# Altium project STM32H743VGT6核心板.PrjPcb
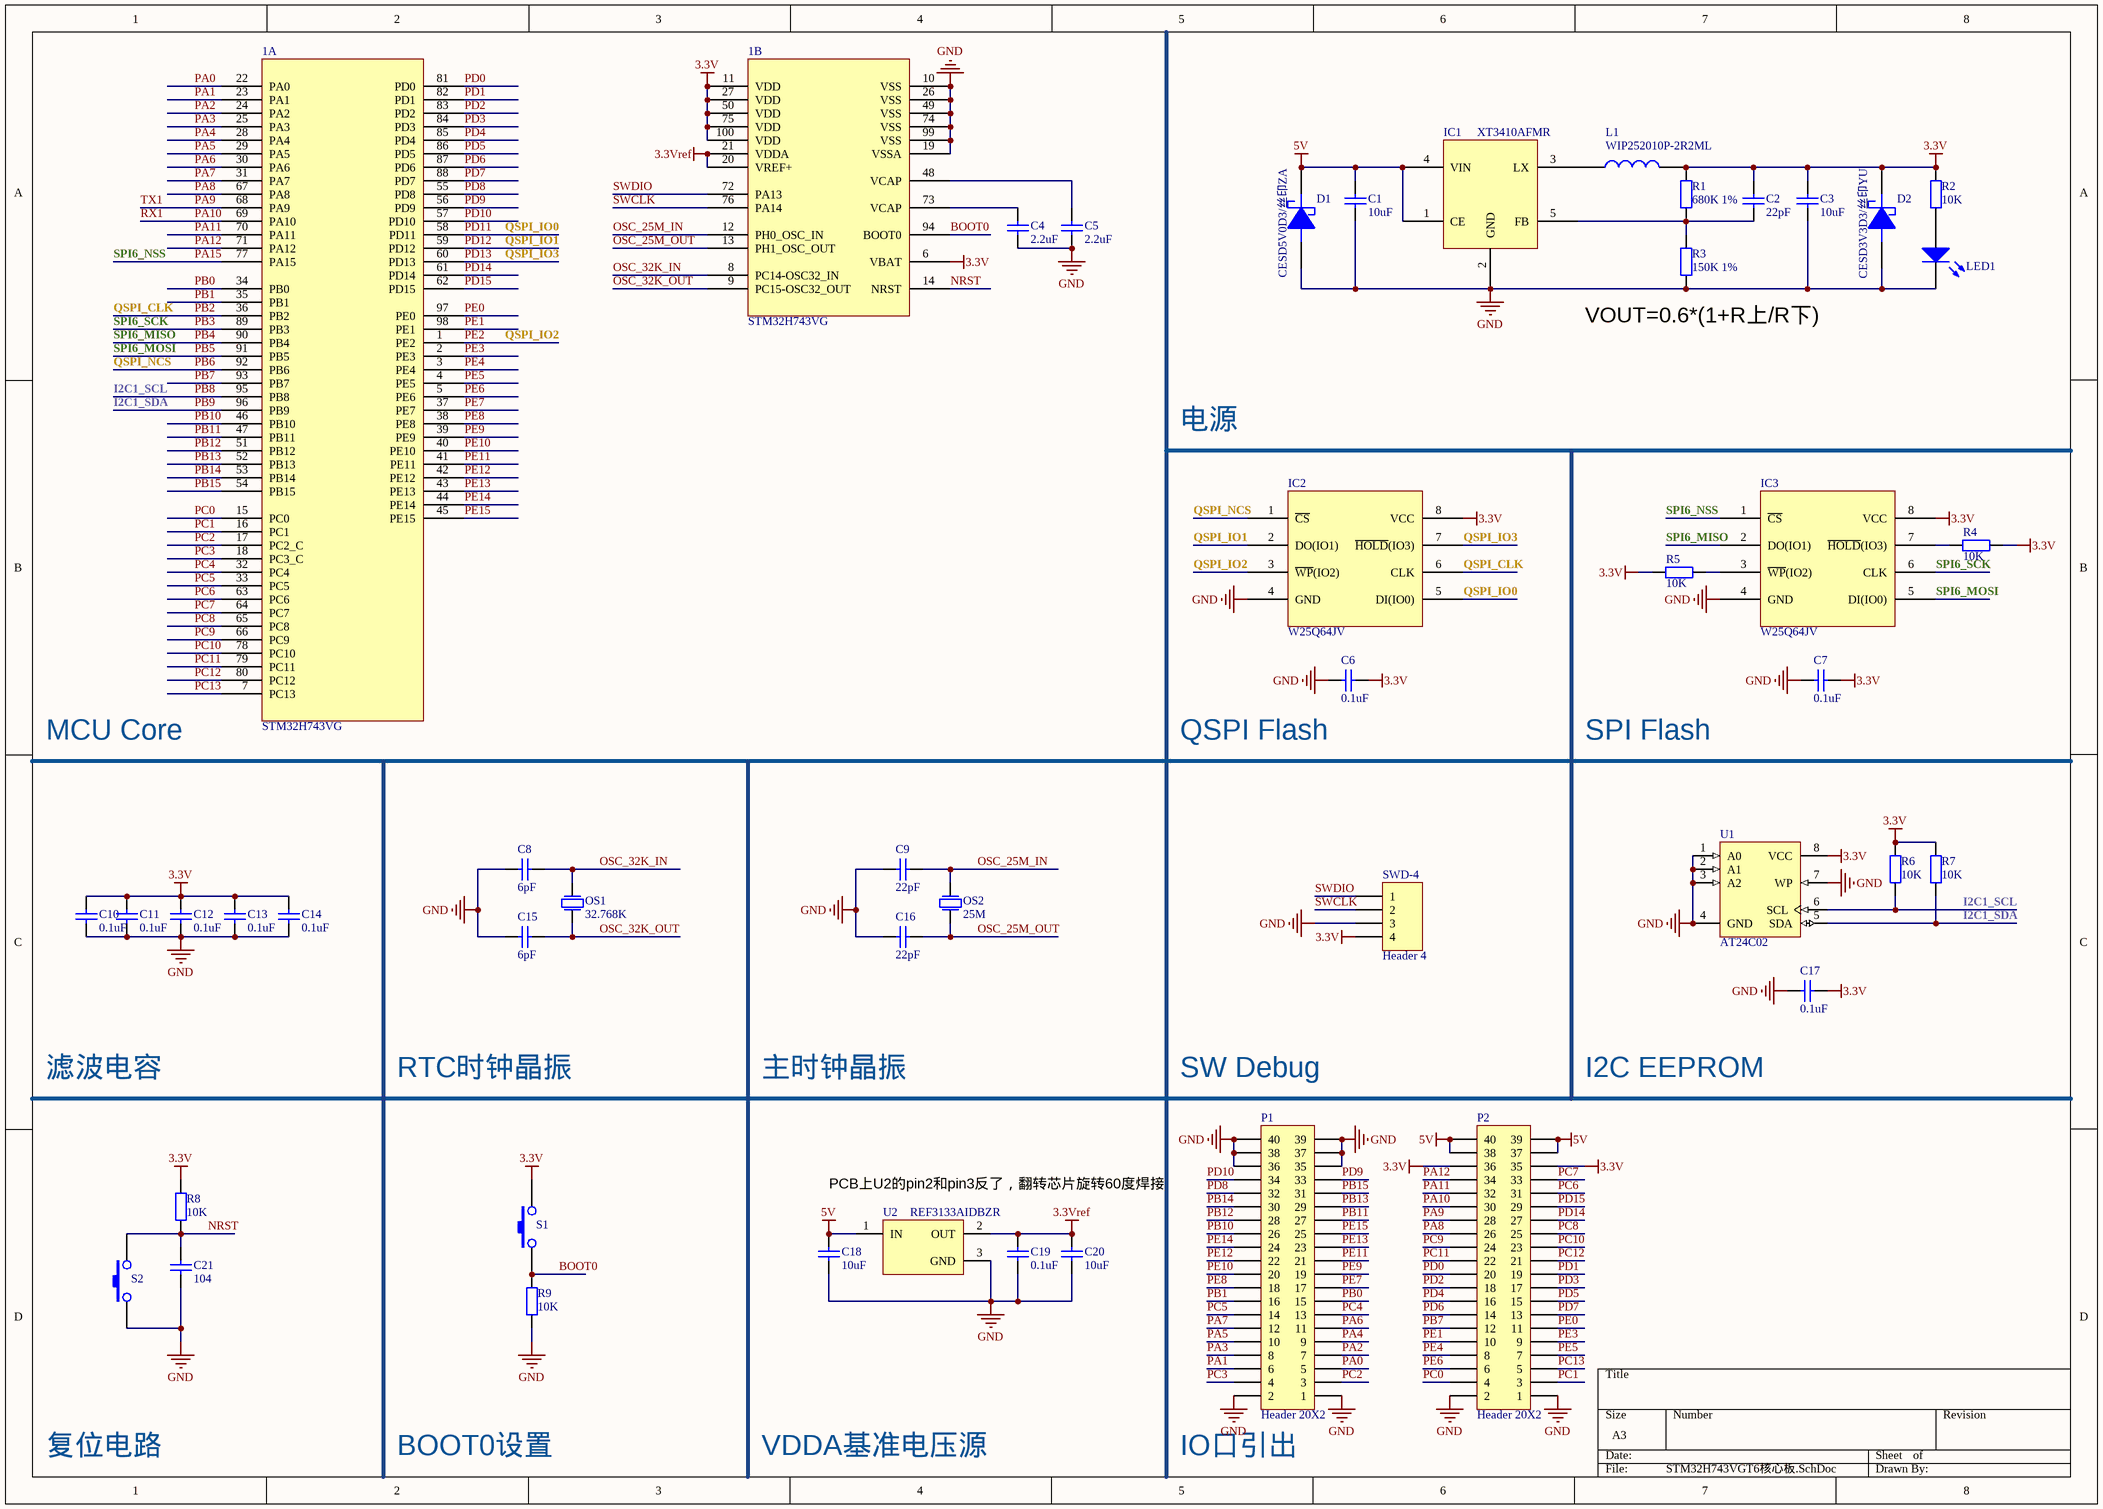
[diagram p0: STM32H743VGT6核心板.SchDoc]
1 sheet, 47 parts. Net scope: global (net labels, ports and power ports of the same name join across sheets).
Board file: STM32H743VGT6核心板.PcbDoc

## Sheet STM32H743VGT6核心板.SchDoc
size A3

### Parts
1  STM32H743VG  [F-QFP14x14-G100/P.5N]  (parts A,B of 2)
C1  10uF  [C 0603_M]
C2  22pF  [C 0603_M]
C3  10uF  [C 0603_M]
C4  2.2uF  [C 0603_M]
C5  2.2uF  [C 0603_M]
C6  0.1uF  [C 0603_M]
C7  0.1uF  [C 0603_M]
C8  6pF  [C 0603_M]
C9  22pF  [C 0603_M]
C10  0.1uF  [C 0603_M]
C11  0.1uF  [C 0603_M]
C12  0.1uF  [C 0603_M]
C13  0.1uF  [C 0603_M]
C14  0.1uF  [C 0603_M]
C15  6pF  [C 0603_M]
C16  22pF  [C 0603_M]
C17  0.1uF  [C 0603_M]
C18  10uF  [C 0603_M]
C19  0.1uF  [C 0603_M]
C20  10uF  [C 0603_M]
C21  104  [C 0603_M]
D1  CESD5V0D3/丝印ZA  [SOD323]
D2  CESD3V3D3/丝印YU  [SOD323]
IC1  XT3410AFMR  [SOT23-5P]
IC2  W25Q64JV  [SOIC-W-8]
IC3  W25Q64JV  [SOIC-W-8]
L1  WIP252010P-2R2ML  [电感2520X10N]
LED1  LED  [LED 0603W]  (value not drawn)
OS1  32.768K  [R 0805_M]
OS2  25M  [3225]
P1  Header 20X2  [HDR-SMD_40P-P1.27-V-M-R2-C20-LS5.3]
P2  Header 20X2  [HDR-SMD_40P-P1.27-V-M-R2-C20-LS5.3]
R1  680K 1%  [R 0603_M]
R2  10K  [R 0603_M]
R3  150K 1%  [R 0603_M]
R4  10K  [R 0603_M]
R5  10K  [R 0603_M]
R6  10K  [R 0603_M]
R7  10K  [R 0603_M]
R8  10K  [R 0603_M]
R9  10K  [R 0603_M]
S1  KEY  [SWT3*4]  (value not drawn)
S2  KEY  [SWT3*4]  (value not drawn)
SWD-4  Header 4  [PH2.0-WI-4P]
U1  AT24C02  [8S1_N]
U2  REF3133AIDBZR  [SOT23]

### Nets
3.3V: 1.6(VBAT) 1.11(VDD) 1.27(VDD) 1.50(VDD) 1.75(VDD) 1.100(VDD) C2.2 C3.2 C6.2 C7.2 C10.2 C11.2 C12.2 C13.2 C14.2 C17.2 D2.2(-) IC2.8(VCC) IC3.8(VCC) L1.2 P2.35 P2.36 R1.2 R2.1 R4.2 R5.1 R6.2 R7.2 R8.2 S1.2 SWD-4.4 U1.8(VCC)
3.3Vref: 1.20(VREF+) 1.21(VDDA) C19.2 C20.2 U2.2(OUT)
5V: C1.2 C18.2 D1.2(-) IC1.1(CE) IC1.4(VIN) P2.37 P2.38 P2.39 P2.40 U2.1(IN)
GND: 1.10(VSS) 1.19(VSSA) 1.26(VSS) 1.49(VSS) 1.74(VSS) 1.99(VSS) C1.1 C3.1 C4.1 C5.1 C6.1 C7.1 C8.2 C9.2 C10.1 C11.1 C12.1 C13.1 C14.1 C15.2 C16.2 C17.1 C18.1 C19.1 C20.1 C21.1 D1.1(+) D2.1(+) IC1.2(GND) IC2.4(GND) IC3.4(GND) LED1.2(K) P1.1 P1.2 P1.35 P1.36 P1.37 P1.38 P1.39 P1.40 P2.1 P2.2 R3.1 R9.1 S2.1 SWD-4.3 U1.1(A0) U1.2(A1) U1.3(A2) U1.4(GND) U1.7(WP) U2.3(GND)
BOOT0: 1.94(BOOT0) R9.2 S1.1
I2C1_SCL: 1.95(PB8) R6.1 U1.6(SCL)  [also labelled PB8]
I2C1_SDA: 1.96(PB9) R7.1 U1.5(SDA)  [also labelled PB9]
NRST: 1.14(NRST) C21.2 R8.1 S2.2
OSC_25M_IN: 1.12(PH0_OSC_IN) C9.1 OS2.1(P1)
OSC_25M_OUT: 1.13(PH1_OSC_OUT) C16.1 OS2.2(P2)
OSC_32K_IN: 1.8(PC14-OSC32_IN) C8.1 OS1.1(P1)
OSC_32K_OUT: 1.9(PC15-OSC32_OUT) C15.1 OS1.2(P2)
PA0: 1.22(PA0) P1.5
PA1: 1.23(PA1) P1.6
PA2: 1.24(PA2) P1.7
PA3: 1.25(PA3) P1.8
PA4: 1.28(PA4) P1.9
PA5: 1.29(PA5) P1.10
PA6: 1.30(PA6) P1.11
PA7: 1.31(PA7) P1.12
PA8: 1.67(PA8) P2.26
PA9: 1.68(PA9) P2.28  [also labelled TX1]
PA10: 1.69(PA10) P2.30  [also labelled RX1]
PA11: 1.70(PA11) P2.32
PA12: 1.71(PA12) P2.34
PA15: 1.77(PA15) IC3.1(~{CS})  [also labelled SPI6_NSS]
PB0: 1.34(PB0) P1.15
PB1: 1.35(PB1) P1.16
PB2: 1.36(PB2) IC2.6(CLK)  [also labelled QSPI_CLK]
PB3: 1.89(PB3) IC3.6(CLK)  [also labelled SPI6_SCK]
PB4: 1.90(PB4) IC3.2(DO(IO1))  [also labelled SPI6_MISO]
PB5: 1.91(PB5) IC3.5(DI(IO0))  [also labelled SPI6_MOSI]
PB6: 1.92(PB6) IC2.1(~{CS})  [also labelled QSPI_NCS]
PB7: 1.93(PB7) P2.12
PB10: 1.46(PB10) P1.26
PB11: 1.47(PB11) P1.27
PB12: 1.51(PB12) P1.28
PB13: 1.52(PB13) P1.29
PB14: 1.53(PB14) P1.30
PB15: 1.54(PB15) P1.31
PC0: 1.15(PC0) P2.4
PC1: 1.16(PC1) P2.3
PC2: 1.17(PC2_C) P1.3
PC3: 1.18(PC3_C) P1.4
PC4: 1.32(PC4) P1.13
PC5: 1.33(PC5) P1.14
PC6: 1.63(PC6) P2.31
PC7: 1.64(PC7) P2.33
PC8: 1.65(PC8) P2.25
PC9: 1.66(PC9) P2.24
PC10: 1.78(PC10) P2.23
PC11: 1.79(PC11) P2.22
PC12: 1.80(PC12) P2.21
PC13: 1.7(PC13) P2.5
PD0: 1.81(PD0) P2.20
PD1: 1.82(PD1) P2.19
PD2: 1.83(PD2) P2.18
PD3: 1.84(PD3) P2.17
PD4: 1.85(PD4) P2.16
PD5: 1.86(PD5) P2.15
PD6: 1.87(PD6) P2.14
PD7: 1.88(PD7) P2.13
PD8: 1.55(PD8) P1.32
PD9: 1.56(PD9) P1.33
PD10: 1.57(PD10) P1.34
PD11: 1.58(PD11) IC2.5(DI(IO0))  [also labelled QSPI_IO0]
PD12: 1.59(PD12) IC2.2(DO(IO1))  [also labelled QSPI_IO1]
PD13: 1.60(PD13) IC2.7(~{HOLD}(IO3))  [also labelled QSPI_IO3]
PD14: 1.61(PD14) P2.27
PD15: 1.62(PD15) P2.29
PE0: 1.97(PE0) P2.11
PE1: 1.98(PE1) P2.10
PE2: 1.1(PE2) IC2.3(~{WP}(IO2))  [also labelled QSPI_IO2]
PE3: 1.2(PE3) P2.9
PE4: 1.3(PE4) P2.8
PE5: 1.4(PE5) P2.7
PE6: 1.5(PE6) P2.6
PE7: 1.37(PE7) P1.17
PE8: 1.38(PE8) P1.18
PE9: 1.39(PE9) P1.19
PE10: 1.40(PE10) P1.20
PE11: 1.41(PE11) P1.21
PE12: 1.42(PE12) P1.22
PE13: 1.43(PE13) P1.23
PE14: 1.44(PE14) P1.24
PE15: 1.45(PE15) P1.25
SWCLK: 1.76(PA14) SWD-4.2
SWDIO: 1.72(PA13) SWD-4.1
Net1_48: 1.48(VCAP) C5.2
Net1_73: 1.73(VCAP) C4.2
NetC2_1: C2.1 IC1.5(FB) R1.1 R3.2
NetIC1_3: IC1.3(LX) L1.1
NetIC3_3: IC3.3(~{WP}(IO2)) R5.2
NetIC3_7: IC3.7(~{HOLD}(IO3)) R4.1
NetLED1_1: LED1.1(A) R2.2

### Notes on the sheet
- (near R3) VOUT=0.6*(1+R上/R下)
- 电源
- MCU Core
- (near C6) QSPI Flash
- SPI Flash
- 滤波电容
- RTC时钟晶振
- 主时钟晶振
- SW Debug
- I2C EEPROM
- PCB上U2的pin2和pin3反了，翻转芯片旋转60度焊接
- 复位电路
- BOOT0设置
- VDDA基准电压源
- (near P1) IO口引出

### Library data of the parts
C1 C3 C18 C20 = Cap1_3: value: 10uF
C2 = Cap1_1: value: 22pF
C4 C5 = Cap1_4: value: 2.2uF
C6-C17 C19 C21 = Cap1
  C6 C7 C10-C14 C17 C19: value: 0.1uF
  C8 C15: value: 6pF
  C9 C16: value: 22pF
  C21: value: 104
D1 = TVS
D2 = TVS_1
IC2 IC3 = W25QXX_FLASH
L1 = 电感_1
OS1 OS2 = 晶振
  OS1: vaule: 32.768K
  OS2: vaule: 25M
P1 P2 = Header 20X2: Header, 20-Pin, Dual row; LatestRevisionDate: 17-Jul-2002; LatestRevisionNote: Re-released for DXP Platform.; Publisher: Altium Limited
R1 = Res_5: value: 680K 1%
R2 R8 R9 = Res: value: 10K
R3 = Res_6: value: 150K 1%
R4-R7 = Res_1: value: 10K
SWD-4 = Header 4: Header, 4-Pin; LatestRevisionDate: 17-Jul-2002; LatestRevisionNote: Re-released for DXP Platform.; Publisher: Altium Limited
U1 = AT24C02BN-SP25-B: 2Kbit (256 x 8), 2-wire Bus Automotive Serial EEPROM with full memory Write Protect, 2.5V, 8-Pin SOIC, Bulk; DatasheetVersion: 8517C,  Jan-2009; PackageVersion: revC, Mar-2005; PackageReference: 8S1; PackageDescription: 8-Lead (0.150" Wide Body), Plastic Gull Wing Small Outline (JEDEC SOIC); Code_JEDEC: MS-012-AA; Code_IPC: SOIC127P600-8; ComponentLink1Description: Manufacturer URL; ComponentLink1URL: http://www.atmel.com/; ComponentLink2Description: Datasheet; ComponentLink2URL: http://www.atmel.com/dyn/resources/prod_documents/doc8517.pdf
U2 = REF3133AIDBZR: 20 ppm / degC Max, 100 uA Series Voltage Reference, -40 to 125 degC, 3-pin SOT-23 (DBZ), Green (RoHS & no Sb/Br); Manufacturer: Texas Instruments; Initial Accuracy @ 25/deg C(%): 0.2; Iq(Max)(uA): 100; Rating: Catalog; Temp Coeff(Max)(ppm/ degree C): 20; Temp Coeff(Typ)(ppm/ degree C): 10; VI(Max)(V): 5.5; VI(Min)(V): 3.35; VO(V): 3.3; DatasheetVersion: SBVS046C; PackageVersion: 4203227/B; PackageReference: DBZ3; PackageDescription: 3-Pin Plastic Small Outline, Body 2.92 x 1.3 mm, Pitch 0.95 mm; Supplier 1: Digi-Key; Supplier Part Number 1: REF3133AIDBZR-ND; Supplier 2: Newark; Supplier Part Number 2: 90H3376; Supplier 3: Mouser; Supplier Part Number 3: 595-REF3133AIDBZR; Eco-Plan: Green (RoHS & no Sb/Br); SubFamily: Series Voltage Reference; Mounting Technology: Surface Mount; Code_JEDEC: TO-236; PartNumber: REF3133AIDBZR; ComponentLink1Description: Manufacturer URL; ComponentLink1URL: http://www.ti.com/; ComponentLink2Description: Datasheet; ComponentLink2URL: http://www.ti.com/general/docs/lit/getliterature.tsp?genericPartNumber=REF3133&fileType=pdf; ComponentLink3Description: Package Specification; ComponentLink3URL: http://www.ti.com/litv/pdf/mpds108a